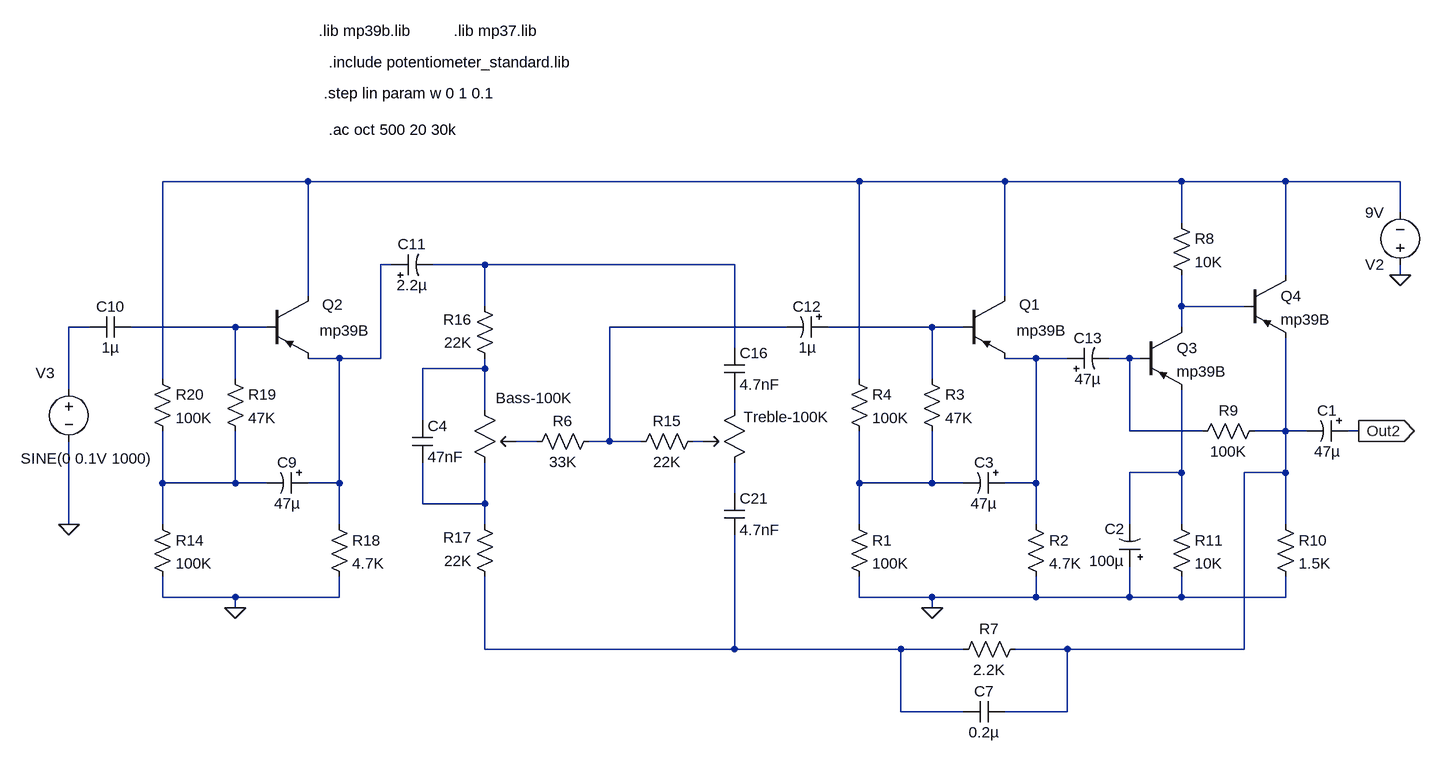
[diagram p0: schematic active EQ 2band.asc]
active EQ 2band.asc, the LTspice schematic file:
Version 4
SHEET 1 984 1092
WIRE -896 0 -1120 0
WIRE -48 0 -896 0
WIRE 176 0 -48 0
WIRE 448 0 176 0
WIRE 608 0 448 0
WIRE 784 0 608 0
WIRE 784 48 784 0
WIRE 448 64 448 0
WIRE -768 128 -784 128
WIRE -624 128 -704 128
WIRE -240 128 -624 128
WIRE 608 144 608 0
WIRE 784 144 784 128
WIRE -896 176 -896 0
WIRE 176 176 176 0
WIRE -624 192 -624 128
WIRE 448 192 448 144
WIRE 544 192 448 192
WIRE -1232 224 -1264 224
WIRE -1008 224 -1168 224
WIRE -960 224 -1008 224
WIRE -160 224 -432 224
WIRE 64 224 -96 224
WIRE 112 224 64 224
WIRE 448 224 448 192
WIRE -240 256 -240 128
WIRE -848 272 -896 272
WIRE -784 272 -784 128
WIRE -784 272 -848 272
WIRE 224 272 176 272
WIRE 272 272 224 272
WIRE 368 272 336 272
WIRE 384 272 368 272
WIRE -624 288 -624 272
WIRE -624 288 -720 288
WIRE -1120 304 -1120 0
WIRE -1008 304 -1008 224
WIRE -48 304 -48 0
WIRE 64 304 64 224
WIRE -1264 320 -1264 224
WIRE -624 352 -624 288
WIRE -240 352 -240 320
WIRE -720 368 -720 288
WIRE 368 384 368 272
WIRE 480 384 368 384
WIRE 608 384 608 240
WIRE 608 384 560 384
WIRE 640 384 608 384
WIRE 720 384 704 384
WIRE -544 400 -576 400
WIRE -432 400 -432 224
WIRE -432 400 -464 400
WIRE -384 400 -432 400
WIRE -288 400 -304 400
WIRE 448 448 448 320
WIRE 448 448 368 448
WIRE 608 448 608 384
WIRE 608 448 544 448
WIRE -1120 464 -1120 384
WIRE -1008 464 -1008 384
WIRE -1008 464 -1120 464
WIRE -960 464 -1008 464
WIRE -848 464 -848 272
WIRE -848 464 -896 464
WIRE -48 464 -48 384
WIRE 64 464 64 384
WIRE 64 464 -48 464
WIRE 112 464 64 464
WIRE 224 464 224 272
WIRE 224 464 176 464
WIRE -240 480 -240 432
WIRE -720 496 -720 432
WIRE -624 496 -624 432
WIRE -624 496 -720 496
WIRE -1264 528 -1264 400
WIRE -1120 528 -1120 464
WIRE -848 528 -848 464
WIRE -624 528 -624 496
WIRE -48 528 -48 464
WIRE 224 528 224 464
WIRE 368 528 368 448
WIRE 448 528 448 448
WIRE 608 528 608 448
WIRE -1120 640 -1120 608
WIRE -1008 640 -1120 640
WIRE -848 640 -848 608
WIRE -848 640 -1008 640
WIRE -48 640 -48 608
WIRE 64 640 -48 640
WIRE 224 640 224 608
WIRE 224 640 64 640
WIRE 368 640 368 592
WIRE 368 640 224 640
WIRE 448 640 448 608
WIRE 448 640 368 640
WIRE 608 640 608 608
WIRE 608 640 448 640
WIRE -1008 656 -1008 640
WIRE 64 656 64 640
WIRE -624 720 -624 608
WIRE -240 720 -240 544
WIRE -240 720 -624 720
WIRE 16 720 -240 720
WIRE 112 720 16 720
WIRE 272 720 192 720
WIRE 544 720 544 448
WIRE 544 720 272 720
WIRE 16 816 16 720
WIRE 112 816 16 816
WIRE 272 816 272 720
WIRE 272 816 176 816
FLAG 784 144 0
FLAG 64 656 0
FLAG 720 384 Out2
IOPIN 720 384 Out
FLAG -1264 528 0
FLAG -1008 656 0
SYMBOL voltage 784 144 R180
WINDOW 123 0 0 Left 2
WINDOW 39 24 -12 Left 2
SYMATTR InstName V2
SYMATTR Value 9V
SYMBOL pnp 112 176 R0
WINDOW 0 86 13 Left 2
WINDOW 3 82 53 Left 2
SYMATTR InstName Q1
SYMATTR Value mp39B
SYMBOL res -64 512 R0
SYMATTR InstName R1
SYMATTR Value 100K
SYMBOL res 208 512 R0
SYMATTR InstName R2
SYMATTR Value 4.7K
SYMBOL res 48 288 R0
SYMATTR InstName R3
SYMATTR Value 47K
SYMBOL res -64 288 R0
SYMATTR InstName R4
SYMATTR Value 100K
SYMBOL pnp 384 224 R0
SYMATTR InstName Q3
SYMATTR Value mp39B
SYMBOL pnp 544 144 R0
SYMATTR InstName Q4
SYMATTR Value mp39B
SYMBOL res 432 48 R0
SYMATTR InstName R8
SYMATTR Value 10K
SYMBOL res 576 368 R90
WINDOW 0 0 56 VBottom 2
WINDOW 3 32 56 VTop 2
SYMATTR InstName R9
SYMATTR Value 100K
SYMBOL res 592 512 R0
SYMATTR InstName R10
SYMATTR Value 1.5K
SYMBOL res 432 512 R0
SYMATTR InstName R11
SYMATTR Value 10K
SYMBOL voltage -1264 304 R0
WINDOW 39 -112 95 Left 2
WINDOW 3 -74 122 Left 2
WINDOW 0 -51 -9 Left 2
SYMATTR Value SINE(0 0.1V 1000)
SYMATTR InstName V3
SYMATTR Value2 AC 1
SYMBOL potentiometer_standard -640 336 R0
WINDOW 0 33 -3 Left 2
WINDOW 3 -201 26 Invisible 2
SYMATTR InstName Bass-100K
SYMATTR Value Rtot=100K wiper={w}
SYMATTR SpiceModel pot_lin
SYMATTR SpiceLine Rtap=50K tap=.5
SYMBOL potentiometer_standard -224 336 M0
WINDOW 0 -132 26 Left 2
WINDOW 3 -201 26 Invisible 2
SYMATTR InstName Treble-100K
SYMATTR Value Rtot=100K wiper={w}
SYMATTR SpiceModel pot_lin
SYMATTR SpiceLine Rtap=50K tap=.5
SYMBOL cap -256 256 R0
SYMATTR InstName C16
SYMATTR Value 4.7nF
SYMBOL res -288 384 R90
WINDOW 0 0 56 VBottom 2
WINDOW 3 32 56 VTop 2
SYMATTR InstName R15
SYMATTR Value 22K
SYMBOL res -608 288 R180
WINDOW 0 36 76 Left 2
WINDOW 3 36 40 Left 2
SYMATTR InstName R16
SYMATTR Value 22K
SYMBOL res -608 624 R180
WINDOW 0 36 76 Left 2
WINDOW 3 36 40 Left 2
SYMATTR InstName R17
SYMATTR Value 22K
SYMBOL cap -256 480 R0
SYMATTR InstName C21
SYMATTR Value 4.7nF
SYMBOL res -448 384 R90
WINDOW 0 0 56 VBottom 2
WINDOW 3 32 56 VTop 2
SYMATTR InstName R6
SYMATTR Value 33K
SYMBOL cap -736 368 R0
SYMATTR InstName C4
SYMATTR Value 47nF
SYMBOL res 208 704 R90
WINDOW 0 0 56 VBottom 2
WINDOW 3 32 56 VTop 2
SYMATTR InstName R7
SYMATTR Value 2.2K
SYMBOL cap 176 800 R90
WINDOW 0 0 32 VBottom 2
WINDOW 3 32 32 VTop 2
SYMATTR InstName C7
SYMATTR Value 0.2µ
SYMBOL pnp -960 176 R0
WINDOW 0 86 13 Left 2
WINDOW 3 82 53 Left 2
SYMATTR InstName Q2
SYMATTR Value mp39B
SYMBOL res -1136 512 R0
SYMATTR InstName R14
SYMATTR Value 100K
SYMBOL res -864 512 R0
SYMATTR InstName R18
SYMATTR Value 4.7K
SYMBOL res -1024 288 R0
SYMATTR InstName R19
SYMATTR Value 47K
SYMBOL res -1136 288 R0
SYMATTR InstName R20
SYMATTR Value 100K
SYMBOL cap -1168 208 R90
WINDOW 0 0 32 VBottom 2
WINDOW 3 32 32 VTop 2
SYMATTR InstName C10
SYMATTR Value 1µ
SYMBOL polcap -896 448 R90
WINDOW 0 0 32 VBottom 2
WINDOW 3 32 32 VTop 2
SYMATTR InstName C9
SYMATTR Value 47µ
SYMBOL polcap -768 144 R270
WINDOW 0 32 32 VTop 2
WINDOW 3 0 32 VBottom 2
SYMATTR InstName C11
SYMATTR Value 2.2µ
SYMBOL polcap -96 208 R90
WINDOW 0 0 32 VBottom 2
WINDOW 3 32 32 VTop 2
SYMATTR InstName C12
SYMATTR Value 1µ
SYMBOL polcap 176 448 R90
WINDOW 0 0 32 VBottom 2
WINDOW 3 32 32 VTop 2
SYMATTR InstName C3
SYMATTR Value 47µ
SYMBOL polcap 272 288 R270
WINDOW 0 32 32 VTop 2
WINDOW 3 0 32 VBottom 2
SYMATTR InstName C13
SYMATTR Value 47µ
SYMBOL polcap 384 592 R180
WINDOW 0 24 57 Left 2
WINDOW 3 24 8 Left 2
SYMATTR InstName C2
SYMATTR Value 100µ
SYMBOL polcap 704 368 R90
WINDOW 0 0 32 VBottom 2
WINDOW 3 32 32 VTop 2
SYMATTR InstName C1
SYMATTR Value 47µ
TEXT -880 -232 Left 2 !.lib mp39b.lib
TEXT -672 -232 Left 2 !.lib mp37.lib
TEXT -864 -184 Left 2 !.include potentiometer_standard.lib
TEXT -872 -136 Left 2 !.step lin param w 0 1 0.1
TEXT -864 -80 Left 2 !.ac oct 500 20 30k

The netlist it stands for:
* active EQ 2band.asc
V2 0 N001 9V
Q1 N001 N008 N009 0 mp39B
R1 N018 0 100K
R2 N009 0 4.7K
R3 N008 N018 47K
R4 N001 N018 100K
Q3 N004 N010 N016 0 mp39B
Q4 N001 N004 N013 0 mp39B
R8 N001 N004 10K
R9 N013 N010 100K
R10 N013 0 1.5K
R11 N016 0 10K
V3 N005 0 SINE(0 0.1V 1000) AC 1
XBass-100K N011 N020 N014 pot_lin Rtot=100K wiper={w} Rtap=50K tap=.5  ; pins A B C
XTreble-100K N012 N019 N015 pot_lin Rtot=100K wiper={w} Rtap=50K tap=.5  ; pins A B C
C16 N003 N012 4.7nF
R15 N015 N007 22K
R16 N011 N003 22K
R17 N021 N020 22K
C21 N019 N021 4.7nF
R6 N007 N014 33K
C4 N011 N020 47nF
R7 N013 N021 2.2K
C7 N013 N021 0.2µ
Q2 N001 N006 N002 0 mp39B
R14 N017 0 100K
R18 N002 0 4.7K
R19 N006 N017 47K
R20 N001 N017 100K
C10 N006 N005 1µ
C9 N002 N017 47µ
C11 N002 N003 2.2µ
C12 N008 N007 1µ
C3 N009 N018 47µ
C13 N009 N010 47µ
C2 0 N016 100µ
C1 Out2 N013 47µ
.model NPN NPN
.model PNP PNP
.lib standard.bjt
.lib mp39b.lib
.lib mp37.lib
.include potentiometer_standard.lib
.step lin param w 0 1 0.1
.ac oct 500 20 30k
.backanno
.end